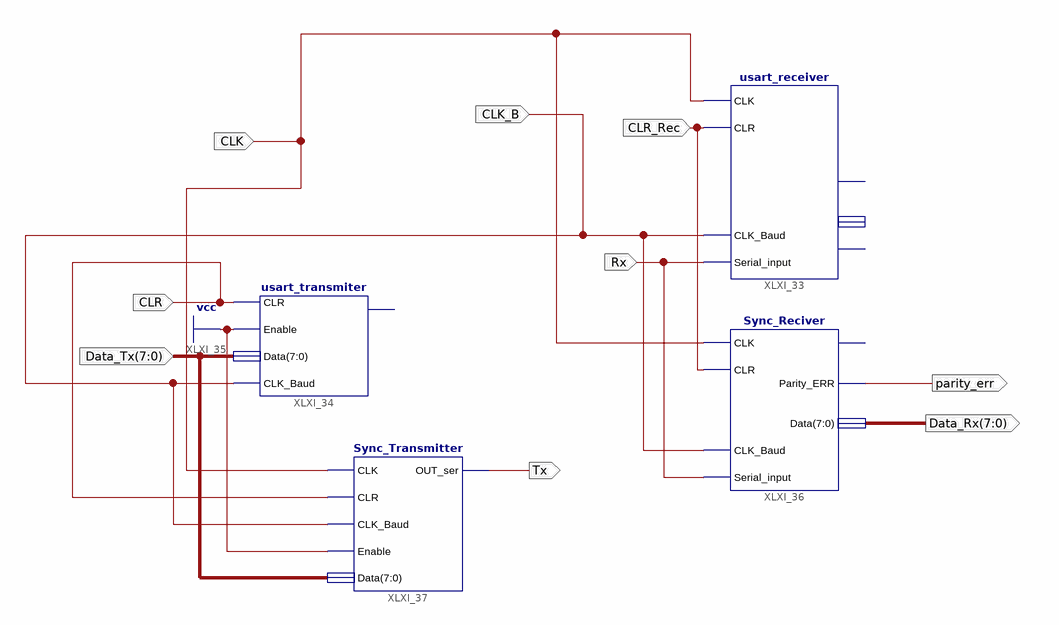
[diagram p0: schematic sheet 1]
// Xilinx ISE schematic test_usart.sch (spartan3e) as structural Verilog: 4 symbols, 9 ports
module test_usart (
  input  CLK_B,
  input  CLK,
  input  CLR,
  input  Rx,
  input  [7:0] Data_Tx,
  input  CLR_Rec,
  output Tx,
  output parity_err,
  output [7:0] Data_Rx
);

  usart_receiver XLXI_33 (
    .CLK_Baud(CLK_B), .Serial_input(Rx), .CLR(CLR_Rec), .CLK(CLK));  // open: Parity_ERR, Data, Data_Ready
  usart_transmiter XLXI_34 (.Enable(1'b1), .CLK_Baud(CLK_B), .Data(Data_Tx), .CLR(CLR));  // open: OUT_ser
  Sync_Reciver XLXI_36 (
    .CLK(CLK), .CLR(CLR_Rec), .Parity_ERR(parity_err), .Data(Data_Rx), .CLK_Baud(CLK_B), .Serial_input(Rx));  // open: Data_Ready
  Sync_Transmitter XLXI_37 (.CLK(CLK), .CLR(CLR), .CLK_Baud(CLK_B), .Enable(1'b1), .Data(Data_Tx), .OUT_ser(Tx));
endmodule
